# EAGLE design driver (EAGLE 8.0.1)

## Sheet 1 of 11: Arduino STM32F103C8T6
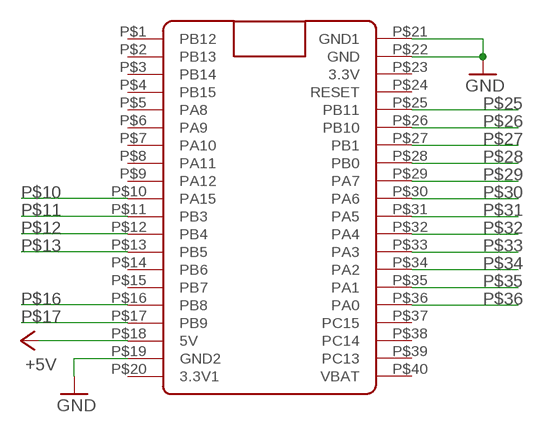
[diagram p0: schematic, sheet 1]

### Parts
U$1  STM32F103C8T6  BLUE_PILLADVANCED  [BLUE_PILL_ADV]

### Nets
+5V: U$1.P$18(5V) ; also sheet 4,5,6,7,8,9,11
GND: U$1.P$19(GND2) U$1.P$21(GND1) U$1.P$22(GND) ; also sheet 2,3,4,5,6,7,8,9,10,11
P$10: U$1.P$10(PA15) ; also sheet 5
P$11: U$1.P$11(PB3) ; also sheet 5
P$12: U$1.P$12(PB4) ; also sheet 5
P$13: U$1.P$13(PB5) ; also sheet 5
P$16: U$1.P$16(PB8) ; also sheet 6
P$17: U$1.P$17(PB9) ; also sheet 6
P$25: U$1.P$25(PB11) ; also sheet 11
P$26: U$1.P$26(PB10) ; also sheet 11
P$27: U$1.P$27(PB1) ; also sheet 11
P$28: U$1.P$28(PB0) ; also sheet 7
P$29: U$1.P$29(PA7) ; also sheet 8
P$30: U$1.P$30(PA6) ; also sheet 7
P$31: U$1.P$31(PA5) ; also sheet 9
P$32: U$1.P$32(PA4) ; also sheet 9
P$33: U$1.P$33(PA3) ; also sheet 10
P$34: U$1.P$34(PA2) ; also sheet 10
P$35: U$1.P$35(PA1) ; also sheet 10
P$36: U$1.P$36(PA0) ; also sheet 10
Unconnected: U$1.P$1(PB12) U$1.P$2(PB13) U$1.P$3(PB14) U$1.P$4(PB15) U$1.P$5(PA8) U$1.P$6(PA9) U$1.P$7(PA10) U$1.P$8(PA11) U$1.P$9(PA12) U$1.P$14(PB6) U$1.P$15(PB7) U$1.P$20(3.3V1) U$1.P$23(3.3V) U$1.P$24(RESET) U$1.P$37(PC15) U$1.P$38(PC14) U$1.P$39(PC13) U$1.P$40(VBAT)

## Sheet 2 of 11: Разъем для аккумулятора, выключатель и перемычки на землю
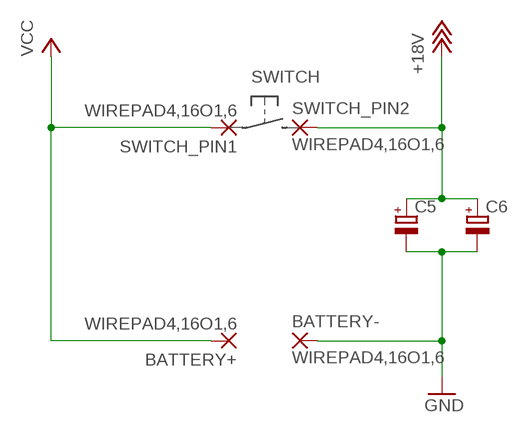
[diagram p1: schematic, sheet 2]

### Parts
BATTERY+  WIREPAD4,16O1,6  [4,16O1,6]
BATTERY-  WIREPAD4,16O1,6  [4,16O1,6]
C5  CPOL-EUE5-8.5  [E5-8,5]
C6  CPOL-EUE2.5-5  [E2,5-5]
SWITCH_PIN1  WIREPAD4,16O1,6  [4,16O1,6]
SWITCH_PIN2  WIREPAD4,16O1,6  [4,16O1,6]

### Nets
+18V: C5.+ C6.+ SWITCH_PIN2.1(P) ; also sheet 3,4,6
GND: BATTERY-.1(P) C5.- C6.- ; also sheet 1,3,4,5,6,7,8,9,10,11
VCC: BATTERY+.1(P) SWITCH_PIN1.1(P)

## Sheet 3 of 11: Линия питания 12V
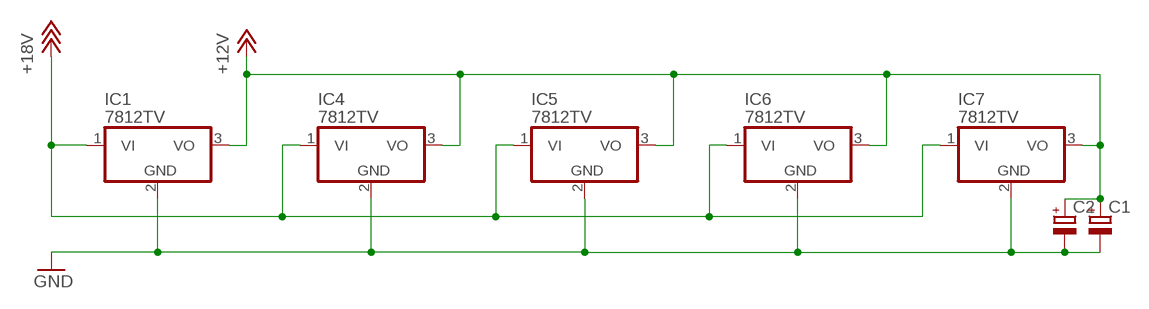
[diagram p2: schematic, sheet 3]

### Parts
C1  CPOL-EUE5-8.5  [E5-8,5]
C2  CPOL-EUE2.5-5  [E2,5-5]
IC1  7812TV  [TO220V]
IC4  7812TV  [TO220V]
IC5  7812TV  [TO220V]
IC6  7812TV  [TO220V]
IC7  7812TV  [TO220V]

### Nets
+12V: C1.+ C2.+ IC1.3(VO) IC4.3(VO) IC5.3(VO) IC6.3(VO) IC7.3(VO) ; also sheet 11
+18V: IC1.1(VI) IC4.1(VI) IC5.1(VI) IC6.1(VI) IC7.1(VI) ; also sheet 2,4,6
GND: C1.- C2.- IC1.2(GND) IC4.2(GND) IC5.2(GND) IC6.2(GND) IC7.2(GND) ; also sheet 1,2,4,5,6,7,8,9,10,11

## Sheet 4 of 11: Линия питания 5V
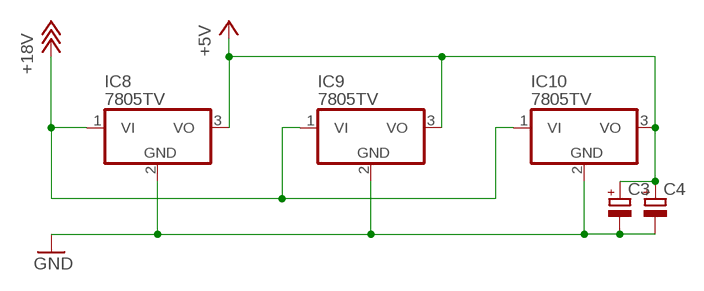
[diagram p3: schematic, sheet 4]

### Parts
C3  CPOL-EUE2.5-5  [E2,5-5]
C4  CPOL-EUE5-8.5  [E5-8,5]
IC8  7805TV  [TO220V]
IC9  7805TV  [TO220V]
IC10  7805TV  [TO220V]

### Nets
+5V: C3.+ C4.+ IC8.3(VO) IC9.3(VO) IC10.3(VO) ; also sheet 1,5,6,7,8,9,11
+18V: IC8.1(VI) IC9.1(VI) IC10.1(VI) ; also sheet 2,3,6
GND: C3.- C4.- IC8.2(GND) IC9.2(GND) IC10.2(GND) ; also sheet 1,2,3,5,6,7,8,9,10,11

## Sheet 5 of 11: Ультразвуковые датчики
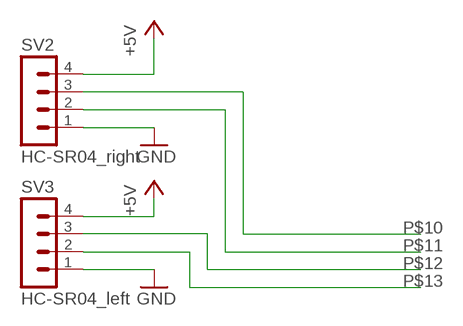
[diagram p4: schematic, sheet 5]

### Parts
SV2  HC-SR04_right  MA04-1  [MA04-1]
SV3  HC-SR04_left  MA04-1  [MA04-1]

### Nets
+5V: SV2.4 SV3.4 ; also sheet 1,4,6,7,8,9,11
GND: SV2.1 SV3.1 ; also sheet 1,2,3,4,6,7,8,9,10,11
P$10: SV2.3 ; also sheet 1
P$11: SV2.2 ; also sheet 1
P$12: SV3.3 ; also sheet 1
P$13: SV3.2 ; also sheet 1

## Sheet 6 of 11: Драйвер электромоторов
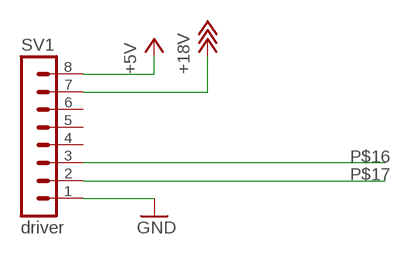
[diagram p5: schematic, sheet 6]

### Parts
SV1  driver  MA08-1  [MA08-1]

### Nets
+5V: SV1.8 ; also sheet 1,4,5,7,8,9,11
+18V: SV1.7 ; also sheet 2,3,4
GND: SV1.1 ; also sheet 1,2,3,4,5,7,8,9,10,11
P$16: SV1.3 ; also sheet 1
P$17: SV1.2 ; also sheet 1
Unconnected: SV1.4 SV1.5 SV1.6

## Sheet 7 of 11: Датчики числа оборотов колес
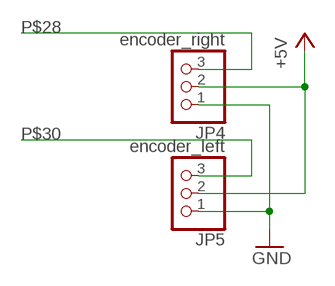
[diagram p6: schematic, sheet 7]

### Parts
JP4  encoder_right  PINHD-1X3  [1X03]
JP5  encoder_left  PINHD-1X3  [1X03]

### Nets
+5V: JP4.2 JP5.2 ; also sheet 1,4,5,6,8,9,11
GND: JP4.1 JP5.1 ; also sheet 1,2,3,4,5,6,8,9,10,11
P$28: JP4.3 ; also sheet 1
P$30: JP5.3 ; also sheet 1

## Sheet 8 of 11: Световая индикация
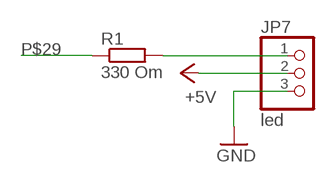
[diagram p7: schematic, sheet 8]

### Parts
JP7  led  PINHD-1X3  [1X03]
R1  330 Om  R-EU_0207/12  [0207/12]

### Nets
+5V: JP7.2 ; also sheet 1,4,5,6,7,9,11
GND: JP7.3 ; also sheet 1,2,3,4,5,6,7,9,10,11
N$16: JP7.1 R1.2
P$29: R1.1 ; also sheet 1

## Sheet 9 of 11: Датчик направления движения
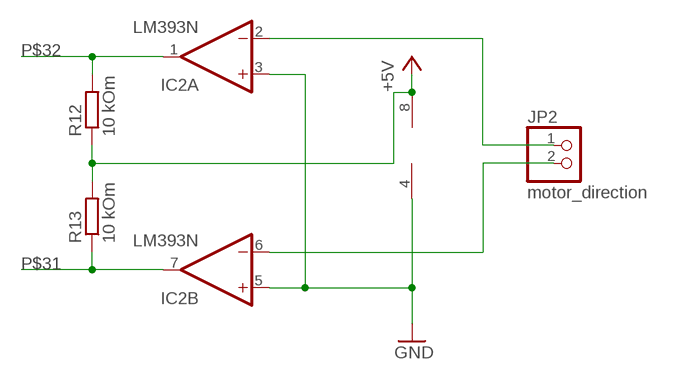
[diagram p8: schematic, sheet 9]

### Parts
IC2  LM393N  [DIL08]
JP2  motor_direction  PINHD-1X2  [1X02]
R12  10 kOm  R-EU_0207/12  [0207/12]
R13  10 kOm  R-EU_0207/12  [0207/12]

### Nets
+5V: IC2.8(P:V+) R12.1 R13.2 ; also sheet 1,4,5,6,7,8,11
GND: IC2.3(A:+IN) IC2.4(P:V-) IC2.5(B:+IN) ; also sheet 1,2,3,4,5,6,7,8,10,11
N$17: IC2.2(A:-IN) JP2.1
N$19: IC2.6(B:-IN) JP2.2
P$31: IC2.7(B:OUT) R13.1 ; also sheet 1
P$32: IC2.1(A:OUT) R12.2 ; also sheet 1

## Sheet 10 of 11: Датчик напряжения аккумулятора
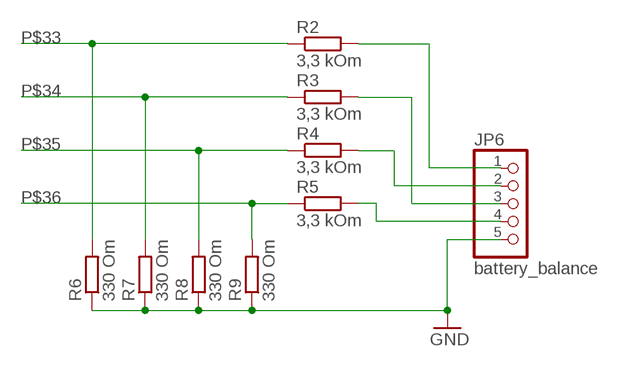
[diagram p9: schematic, sheet 10]

### Parts
JP6  battery_balance  PINHD-1X55X2MM  [1_05X2MM]
R2  3,3 kOm  R-EU_0207/15  [0207/15]
R3  3,3 kOm  R-EU_0207/15  [0207/15]
R4  3,3 kOm  R-EU_0207/15  [0207/15]
R5  3,3 kOm  R-EU_0207/15  [0207/15]
R6  330 Om  R-EU_0207/15  [0207/15]
R7  330 Om  R-EU_0207/15  [0207/15]
R8  330 Om  R-EU_0207/15  [0207/15]
R9  330 Om  R-EU_0207/15  [0207/15]

### Nets
GND: JP6.5 R6.1 R7.1 R8.1 R9.1 ; also sheet 1,2,3,4,5,6,7,8,9,11
N$5: JP6.4 R5.2
N$6: JP6.2 R4.2
N$7: JP6.3 R3.2
N$8: JP6.1 R2.2
P$33: R2.1 R6.2 ; also sheet 1
P$34: R3.1 R7.2 ; also sheet 1
P$35: R4.1 R8.2 ; also sheet 1
P$36: R5.1 R9.2 ; also sheet 1

## Sheet 11 of 11: Рулевое управление
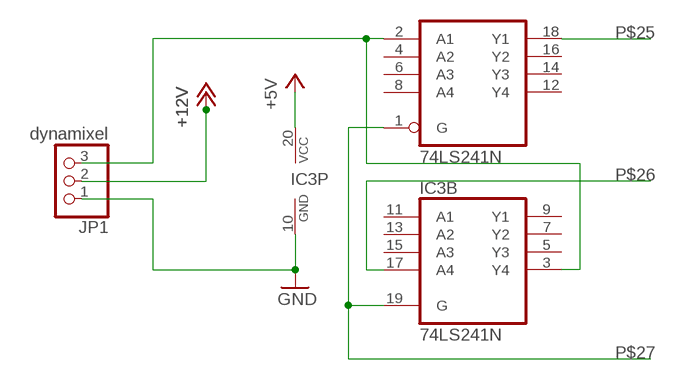
[diagram p10: schematic, sheet 11]

### Parts
IC3  74LS241N  [DIL20]
JP1  dynamixel  PINHD-1X3  [1X03]

### Nets
+5V: IC3.20(P:VCC) ; also sheet 1,4,5,6,7,8,9
+12V: JP1.2 ; also sheet 3
GND: IC3.10(P:GND) JP1.1 ; also sheet 1,2,3,4,5,6,7,8,9,10
N$2: IC3.2(A:A1) IC3.3(B:Y4) JP1.3
P$25: IC3.18(A:Y1) ; also sheet 1
P$26: IC3.17(B:A4) ; also sheet 1
P$27: IC3.1(A:G) IC3.19(B:G) ; also sheet 1
Unconnected: IC3.4(A:A2) IC3.5(B:Y3) IC3.6(A:A3) IC3.7(B:Y2) IC3.8(A:A4) IC3.9(B:Y1) IC3.11(B:A1) IC3.12(A:Y4) IC3.13(B:A2) IC3.14(A:Y3) IC3.15(B:A3) IC3.16(A:Y2)

## Library data of the parts
BATTERY+ BATTERY- SWITCH_PIN1 SWITCH_PIN2 = wirepad:WIREPAD: Wire PAD connect wire on PCB
C1-C6 = resistor:CPOL-EU: POLARIZED CAPACITOR, European symbol
IC1 IC4-IC10 = linear:78*: Positive VOLTAGE REGULATOR Source: http://cache.national.com/ds/LM/LM78L05.pdf http://www.fairchildsemi.com/ds/LM/LM7805.pdf
IC2 = linear:LM393: COMPARATOR
IC3 = 74xx-eu:74*241: Octal BUFFER and LINE DRIVER, 3-state
JP1 JP4 JP5 JP7 = pinhead:PINHD-1X3: PIN HEADER
JP2 = pinhead:PINHD-1X2: PIN HEADER
JP6 = pinhead:PINHD-1X5: PIN HEADER
R1-R9 R12 R13 = resistor:R-EU_: RESISTOR, European symbol
SV1 = con-lstb:MA08-1: PIN HEADER; OC_FARNELL: unknown; OC_NEWARK: unknown
SV2 SV3 = con-lstb:MA04-1: PIN HEADER; OC_FARNELL: unknown; OC_NEWARK: unknown
U$1 = BluePill:BLUE_PILL

## Board
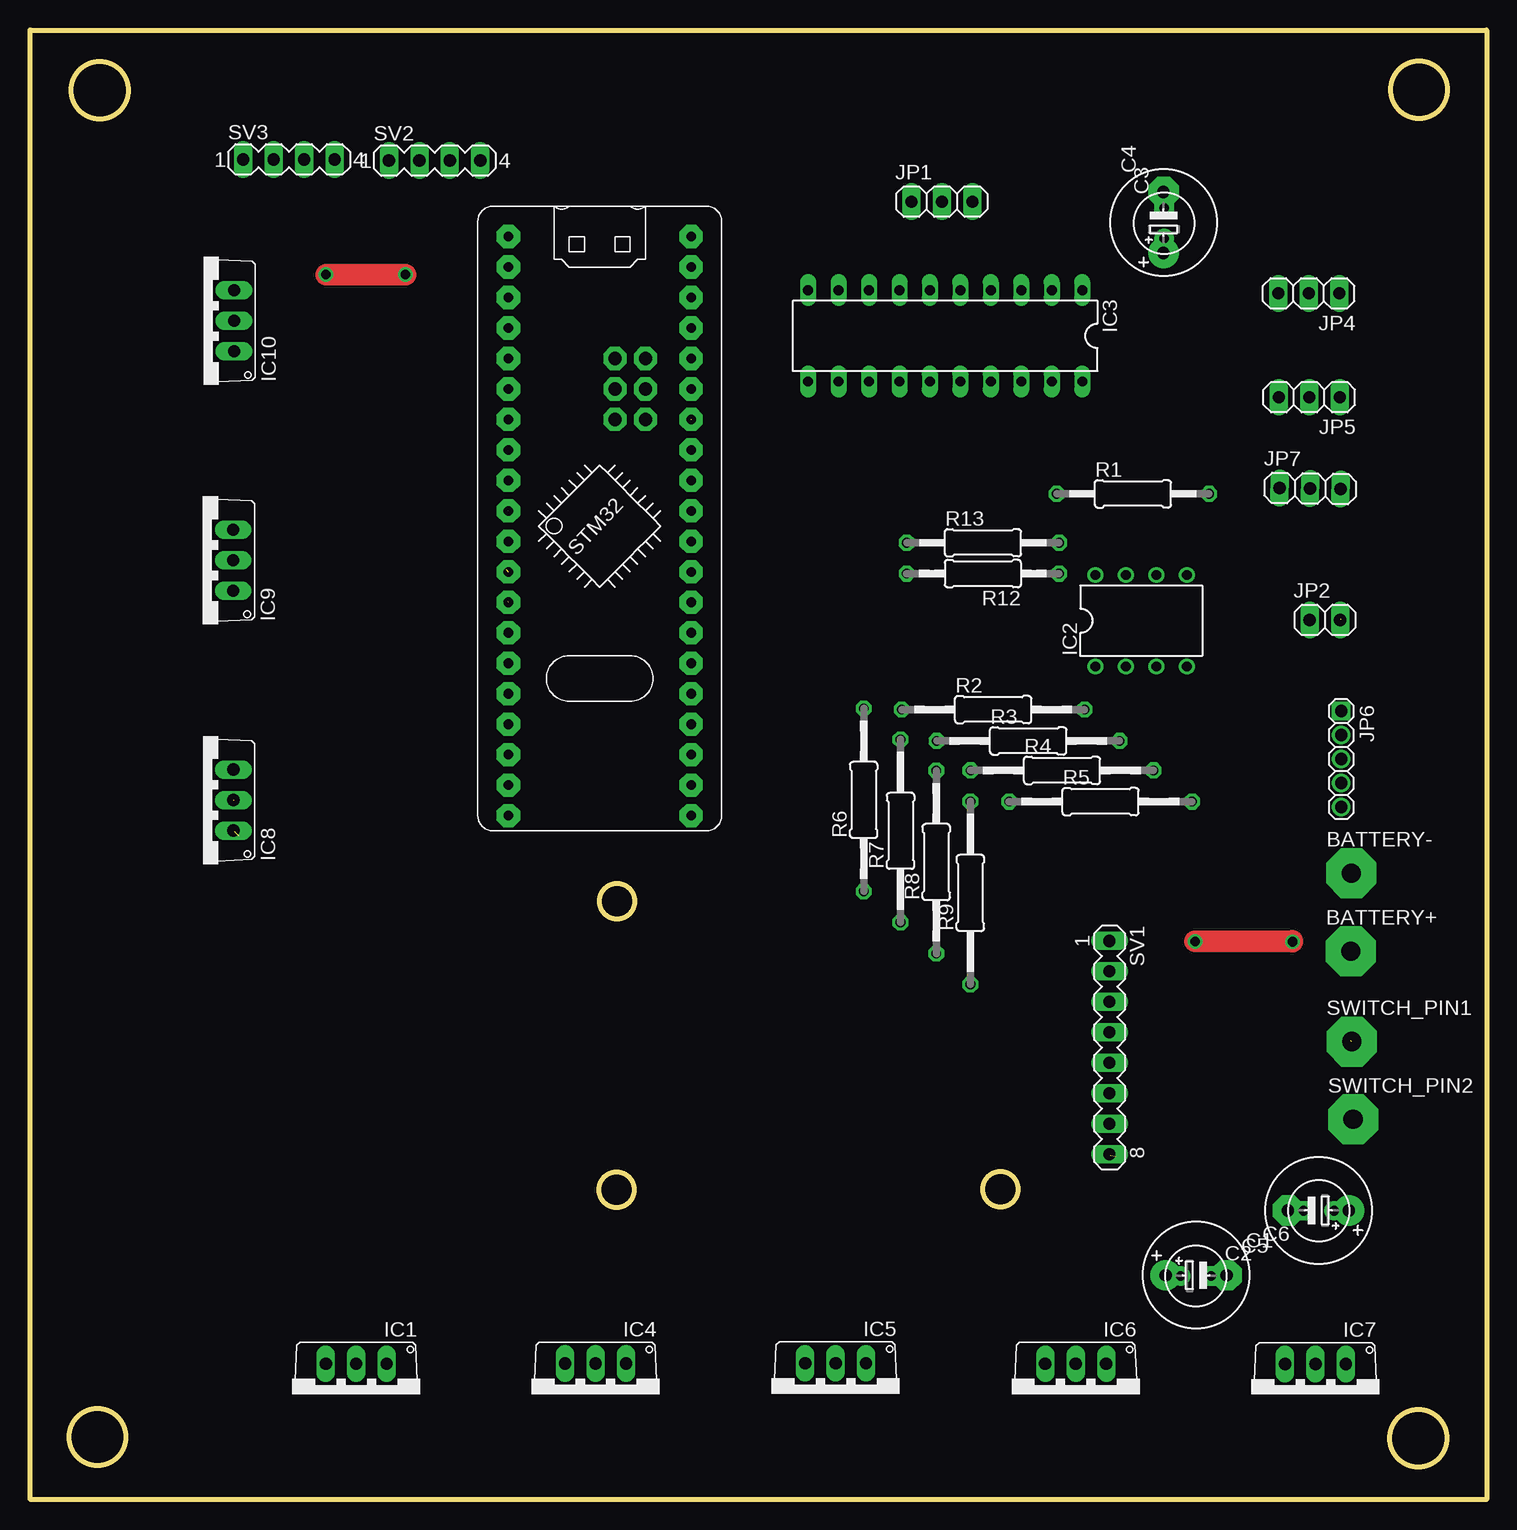
[diagram p11: board, top side]
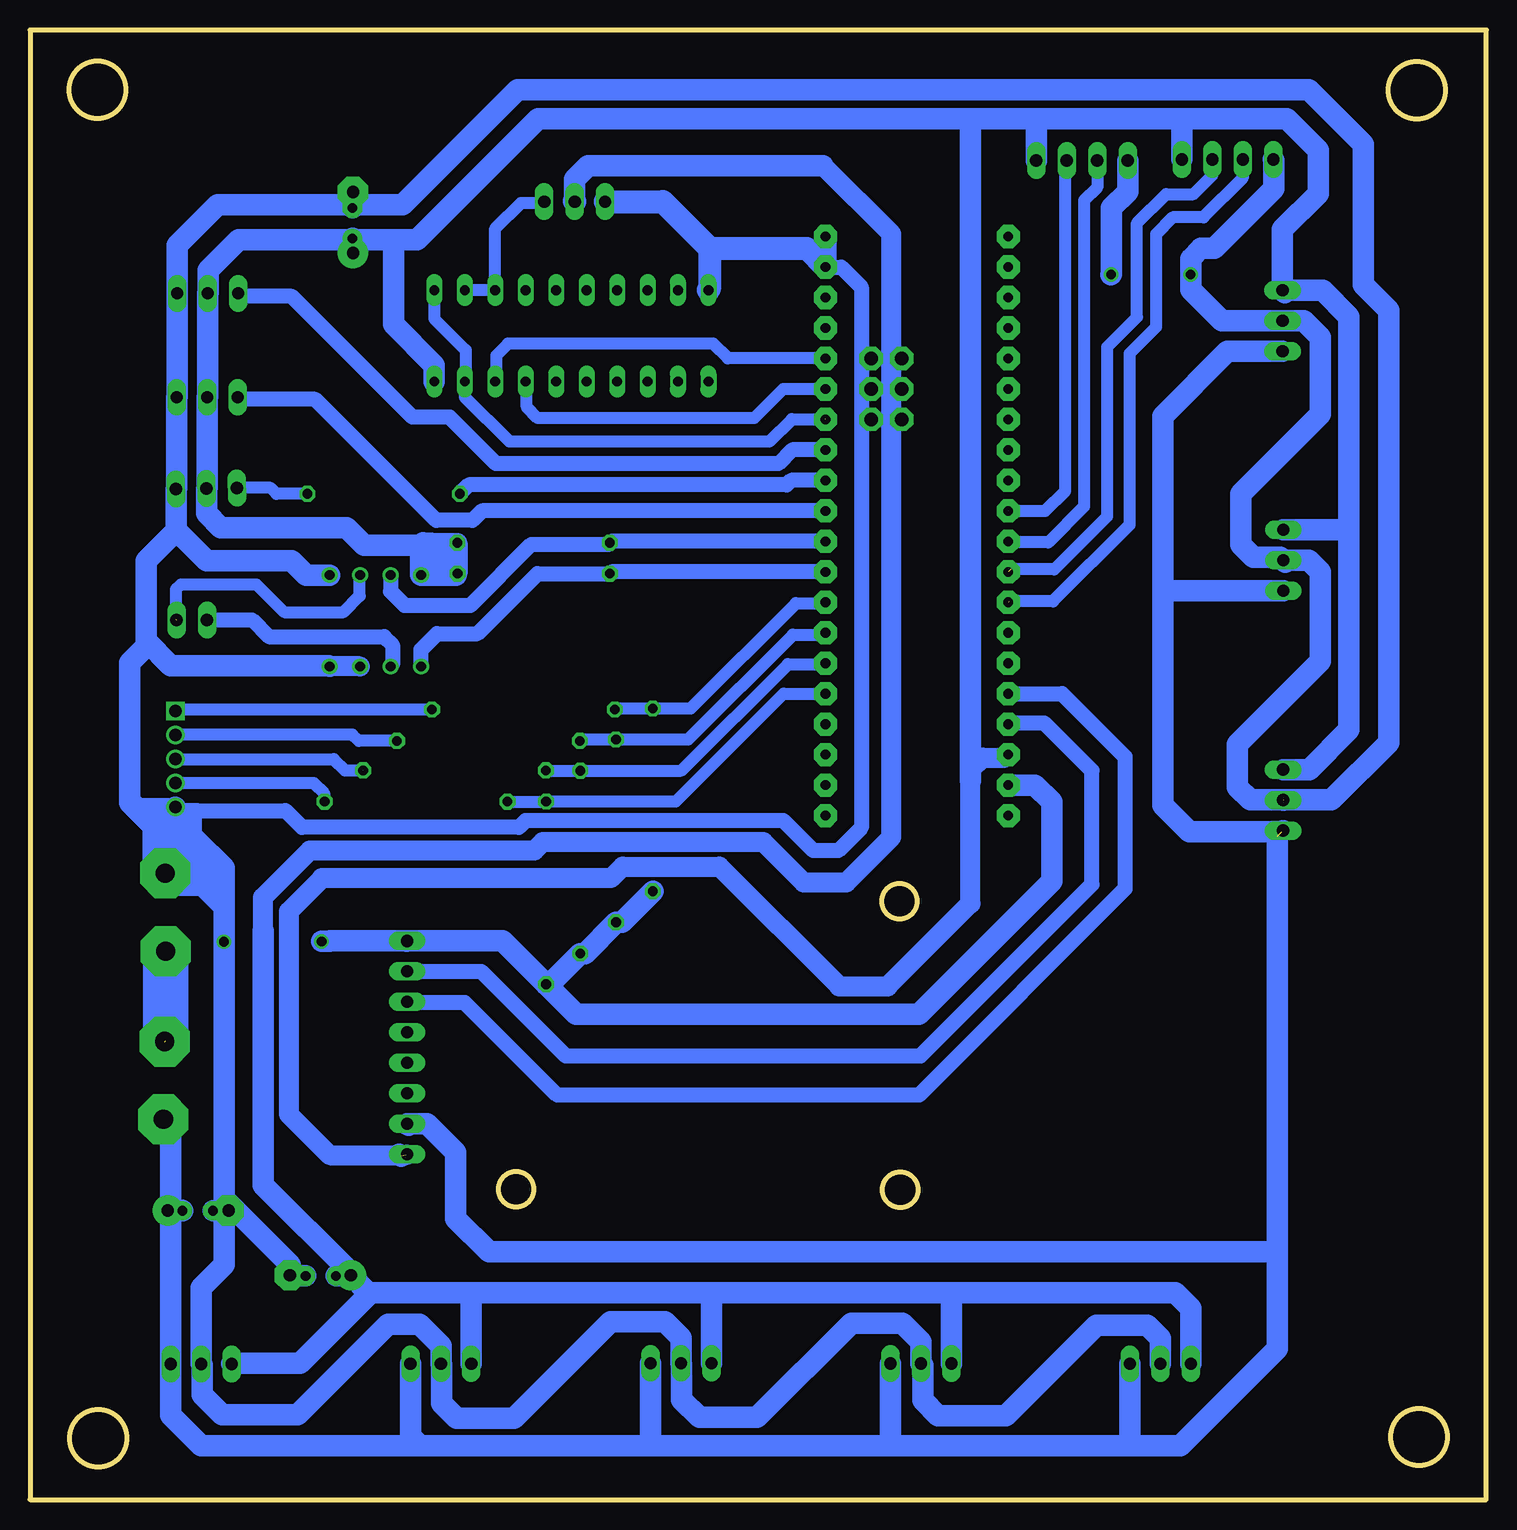
[diagram p12: board, bottom side, seen from below]

Size 121.42 x 122.46 mm. Coordinates in mm from the lower left corner, seen from the top.
Outline: 0,122.45 0.04,122.45 0.04,0 121.38,0
Outline: 0.05,122.46 121.42,122.46 121.42,0.01
Outline: circle at 115.72,5.1 radius 2.37
Outline: circle at 115.79,117.49 radius 2.37
Outline: circle at 48.88,25.83 radius 1.47
Outline: circle at 80.91,25.85 radius 1.47
Outline: circle at 48.95,49.85 radius 1.47
Outline: circle at 5.81,117.45 radius 2.37
Outline: circle at 5.63,5.21 radius 2.37
Copper layers (1*16): Top 0.035mm / dielectric 1.5mm / Bottom 0.035mm
Design rules "default": minimum track width 10mil, minimum drill 24mil, track to track 8mil, track to pad 8mil, pad to pad 8mil, via to via 8mil, smd to smd 8mil, copper to edge 40mil, drill to drill 8mil, minimum pad ring 10mil, minimum via ring 8mil, stop-mask expansion 4mil, vias tented up to drill 0mil, thermal gap 10mil

### Footprints (pad centres in the part's own frame; a part is rotated, then mirrored left to right if it is on the bottom)
4,16O1,6 = drill 1.6 pad 4.166 octagon: 1 0,0
E5-8,5 = drill 1.016 pad 2.54: + -2.54,0 | drill 1.016 pad 2.54 octagon: - 2.54,0
E2,5-5 = drill 0.813 pad 1.6: + -1.27,0 | drill 0.813 pad 1.6 octagon: - 1.27,0
TO220V = drill 1.016 long: 1 -2.54,-2.54; 2 0,-2.54; 3 2.54,-2.54
DIL08 = drill 0.813 pad 1.27: 1 -3.81,-3.81; 2 -1.27,-3.81; 3 1.27,-3.81; 4 3.81,-3.81; 5 3.81,3.81; 6 1.27,3.81; 7 -1.27,3.81; 8 -3.81,3.81
DIL20 = drill 0.813 long: 1 -11.43,-3.81; 2 -8.89,-3.81; 3 -6.35,-3.81; 4 -3.81,-3.81; 5 -1.27,-3.81; 6 1.27,-3.81; 7 3.81,-3.81; 8 6.35,-3.81; 9 8.89,-3.81; 10 11.43,-3.81; 11 11.43,3.81; 12 8.89,3.81; 13 6.35,3.81; 14 3.81,3.81; 15 1.27,3.81; 16 -1.27,3.81; 17 -3.81,3.81; 18 -6.35,3.81; 19 -8.89,3.81; 20 -11.43,3.81
1X03 = drill 1.016 long: 1 -2.54,0; 2 0,0; 3 2.54,0
1X02 = drill 1.016 long: 1 -1.27,0; 2 1.27,0
1_05X2MM = drill 1.016 pad 1.3 square: 1 -4,0 | drill 1.016 pad 1.3: 2 0,0; 3 -2,0; 4 2,0; 5 4,0
0207/12 = drill 0.813 octagon: 1 -6.35,0; 2 6.35,0
0207/15 = drill 0.813 octagon: 1 -7.62,0; 2 7.62,0
MA08-1 = drill 1.016 long: 1 -8.89,0; 2 -6.35,0; 3 -3.81,0; 4 -1.27,0; 5 1.27,0; 6 3.81,0; 7 6.35,0; 8 8.89,0
MA04-1 = drill 1.016 long: 1 -3.81,0; 2 -1.27,0; 3 1.27,0; 4 3.81,0
BLUE_PILL_ADV = drill 0.8 pad 1.93 octagon: P$1 10.16,-30.48; P$2 10.16,-27.94; P$3 10.16,-25.4; P$4 10.16,-22.86; P$5 10.16,-20.32; P$6 10.16,-17.78; P$7 10.16,-15.24; P$8 10.16,-12.7; P$9 10.16,-10.16; P$10 10.16,-7.62; P$11 10.16,-5.08; P$12 10.16,-2.54; P$13 10.16,0; P$14 10.16,2.54; P$15 10.16,5.08; P$16 10.16,7.62; P$17 10.16,10.16; P$18 10.16,12.7; P$19 10.16,15.24; P$20 10.16,17.78; P$21 -5.08,-30.48; P$22 -5.08,-27.94; P$23 -5.08,-25.4; P$24 -5.08,-22.86; P$25 -5.08,-20.32; P$26 -5.08,-17.78; P$27 -5.08,-15.24; P$28 -5.08,-12.7; P$29 -5.08,-10.16; P$30 -5.08,-7.62; P$31 -5.08,-5.08; P$32 -5.08,-2.54; P$33 -5.08,0; P$34 -5.08,2.54; P$35 -5.08,5.08; P$36 -5.08,7.62; P$37 -5.08,10.16; P$38 -5.08,12.7; P$39 -5.08,15.24; P$40 -5.08,17.78 | drill 1.1 pad 1.93 octagon: P$42 -1.27,-20.32; P$43 -1.27,-17.78; P$44 -1.27,-15.24; P$45 1.27,-15.24; P$46 1.27,-17.78; P$47 1.27,-20.32

### Placement (x,y rotation side)
BATTERY+  110.11,45.69 0 top
BATTERY-  110.15,52.2 0 top
C1  97.21,18.69 0 top
C2  97.18,18.63 0 top
C3  94.54,106.36 90 top
C4  94.49,106.42 90 top
C5  107.4,24.09 180 top
C6  107.44,24.07 180 top
IC1  27.2,8.78 180 top
IC2  92.63,73.23 0 top
IC3  76.29,96.97 180 top
IC4  47.14,8.79 180 top
IC5  67.16,8.82 180 top
IC6  87.17,8.78 180 top
IC7  107.16,8.76 180 top
IC8  14.42,58.29 90 top
IC9  14.4,78.27 90 top
IC10  14.47,98.22 90 top
JP1  76.01,108.16 0 top
JP2  107.94,73.3 0 top
JP4  106.6,100.51 180 top
JP5  106.64,91.86 180 top
JP6  109.3,61.71 270 top
JP7  106.71,84.25 359 top
R1  91.94,83.81 0 top
R2  80.29,65.83 0 top
R3  83.21,63.22 0 top
R4  86.03,60.76 0 top
R5  89.24,58.16 0 top
R6  69.5,58.3 90 top
R7  72.57,55.72 90 top
R8  75.55,53.12 90 top
R9  78.39,50.55 90 top
R12  79.43,77.16 180 top
R13  79.44,79.73 0 top
SV1  89.99,37.66 270 top
SV2  33.73,111.58 0 top
SV3  21.59,111.67 0 top
SWITCH_PIN1  110.18,38.16 0 top
SWITCH_PIN2  110.3,31.68 0 top
U$1  50.03,74.77 180 top

### Tracks (layer width: path | path; a pad name or v marks a point on that pad's centre or on a via)
+5V  (1 unrouted)
  Bottom 1.016: 106.71,91.79 JP5.2 | JP4.2 106.64,100.47 | 88.7,77.16 IC2.8 | 87.96,92.92 IC3.20
  Bottom 1.676: U$1.P$18 40.11,61.83 42,61.83 43.02,60.81 43.02,59.9 43.02,49.67 49.93,42.76 53.96,42.76 63.95,52.75 72.02,52.75 72.99,51.78 97.07,51.78 99.85,49 99.85,32.12 96.44,28.71 90.05,28.71 SV1.8 | 87.83,79.73 88.67,79.73 88.67,78.66 87.58,77.57 88.33,77.57 88.84,77.06 | 87.83,79.73 R13.2 R12.1 85.78,77.68 87.83,79.73
  Bottom 1.778: 88.88,79.52 93.57,79.52 95.04,80.99 105.53,80.99 106.71,82.17 JP7.2 106.64,84.32 JP5.2 106.6,91.9 JP4.2 106.56,100.55 106.56,102.45 104.02,104.99 95.42,104.99 | 88.88,79.52 88.84,79.48 88.84,77.06 IC2.8 | IC2.8 85.9,77.04 | 88.88,79.52 88.67,79.73 | IC2.8 88.48,77.04 | 25.4,112.14 SV3.4 25.4,114.97 25.32,115.05 | U$1.P$18 39.82,62.12 | 39.84,62.1 U$1.P$18 | 16.81,100.56 IC10.3 | 39.82,62.02 U$1.P$18 | 90.66,28.76 90.5,28.6 | IC10.3 13.66,100.76 11.47,98.57 11.47,81.16 | 11.47,81.16 11.47,64.15 14.79,60.83 IC8.3 | IC9.3 11.82,80.81 11.47,81.16 | IC10.3 17.01,105.86 14.04,108.83 14.04,112.44 16.65,115.05 25.32,115.05 | 25.32,115.05 37.38,115.05 | 42.57,115.05 37.38,115.05 | 42.57,115.05 79.07,115.05 89.13,104.99 91.05,104.99 | 95.42,104.99 91.05,104.99 | IC3.20 87.72,94.52 91.12,97.92 91.12,104.92 91.05,104.99 | SV2.4 37.54,114.89 37.38,115.05 | 43.02,59.9 43.02,114.6 42.57,115.05 | C3.+ 94.49,105.04 C4.+ 94.49,104.06 95.42,104.99
+12V
  Bottom 1.016: 75.84,108.33 JP1.2
  Bottom 1.676: 102,47.39 102,50.18 98.1,54.08 79.38,54.08 78.68,54.78 60.29,54.78 56.92,51.41 53.39,51.41 49.61,55.19 49.61,105.47 55.3,111.16
  Bottom 1.778: IC1.3 24.66,15.96 25.94,17.24 44.44,17.24 | 64.87,17.24 84.69,17.24 | 44.44,17.24 64.87,17.24 | 84.69,17.24 93.03,17.24 | 93.03,17.24 98.92,11.35 104.57,11.35 IC7.3 | IC6.3 84.63,17.18 84.69,17.24 | IC5.3 64.62,16.99 64.87,17.24 | IC4.3 44.6,17.08 44.44,17.24 | 102,47.39 102,26.21 94.67,18.88 C1.+ | JP1.2 76.01,110.03 74.88,111.16 55.3,111.16 | C2.+ 94.67,18.63 C1.+ | 93.03,17.24 93.22,17.24 C1.+
  Bottom 1.93: 76.04,108.19 JP1.2
+18V  (1 unrouted)
  Bottom 1.778: 90.01,31.29 SV1.7 | 89.86,31.18 SV1.7 | 49.53,4.48 29.73,4.48 | 70,4.48 49.53,4.48 | 88.91,4.48 70,4.48 | 88.91,4.48 107.17,4.48 109.7,7.01 IC7.1 109.7,24.84 | 29.73,4.48 25.53,4.48 17.45,12.56 17.45,20.31 | 17.45,20.31 17.45,55.26 | IC1.1 29.74,4.49 29.73,4.48 | IC4.1 49.68,4.63 49.53,4.48 | IC5.1 69.7,4.78 70,4.48 | IC6.1 89.71,5.28 88.91,4.48 | 109.7,30.35 109.7,24.84 | 109.7,30.35 109.7,31.36 110.6,32.26 | SV1.7 88.3,31.31 85.93,28.94 85.93,23.41 83.16,20.64 17.78,20.64 17.45,20.31 | 16.99,55.72 IC8.1 17.07,55.64 24.76,55.64 26.98,57.86 26.98,75.24 | IC10.1 21.59,95.68 26.98,90.29 26.98,75.24 | IC9.1 26.49,75.73 26.98,75.24 | C6.+ 108.73,24.09 C5.+ 109.94,24.6 109.7,24.84 | SWITCH_PIN2.1 110.3,31.25 110.6,30.95 110.3,30.95 109.7,30.35
GND  (via drill 0.8 pad 1.02)  (1 unrouted)
  Top 1.778: v97.11,46.51 105.2,46.51 105.24,46.55 v105.24,46.48 | v31.3,102.08 24.69,102.08 24.67,102.06 v24.67,102.08
  Bottom 1.016: R9.1 75.82,45.5 R8.1 72.95,48.1 R7.1 69.99,50.68 R6.1 69.52,50.7 | 109.25,91.79 JP5.1 | 109.18,100.47 JP4.1 | JP7.3 109.17,84.13
  Bottom 1.27: U$1.P$22 53.79,102.71 52.11,101.03 52.11,56 54.03,54.08 56.12,54.08 58.61,56.57 80.12,56.57 80.67,56.02 98.74,56.02 100.12,57.4 107.5,57.4 | 107.5,57.4 108.99,57.4 JP6.5 | 107.69,55.08 107.69,57.22 107.5,57.4
  Bottom 1.676: IC2.3 IC2.4 | 105.24,24.52 105.24,23.34 | v97.11,46.51 97.04,46.51
  Bottom 1.778: IC1.2 27.2,13.45 28.28,14.53 32.52,14.53 40.05,7 45.73,7 47,8.27 47,11.19 IC4.2 47.14,13.15 48.69,14.7 52.96,14.7 60.81,6.85 65.61,6.85 67.09,8.33 67.09,11.29 IC5.2 67.16,13.47 68.5,14.81 73.02,14.81 81.06,6.77 85.85,6.77 87.12,8.04 87.12,11.27 IC6.2 87.17,12.81 88.96,14.6 91.57,14.6 99.11,7.06 105.39,7.06 107.08,8.75 107.08,11.22 IC7.2 107.16,17.66 105.24,19.58 105.24,23.34 105.24,25.06 | 78.42,42.9 R9.1 | R9.1 78.12,42.93 R8.1 75.17,45.5 R7.1 72.08,48.1 R6.1 | SV2.1 29.92,109 31.28,107.64 31.28,102.1 v31.3,102.08 | SV1.1 82.01,46.55 R9.1 | IC2.5 98.4,77.04 99.59,78.23 106.7,78.23 109.23,80.76 | 109.23,80.76 109.23,84.19 JP7.3 109.18,84.28 JP5.1 109.14,91.9 JP4.1 109.14,104.52 105.76,107.9 94.02,107.9 | 109.23,80.76 109.23,80.75 111.75,78.23 111.75,71.57 | 111.75,71.57 109.68,69.5 96.52,69.5 IC2.4 | 111.75,71.57 111.75,71.1 113.12,69.73 113.12,58.23 | 113.12,58.23 112.44,57.55 109.46,57.55 JP6.5 109.3,56.7 107.69,55.08 105.24,52.64 105.24,49.4 | 94.02,107.9 90.34,107.9 80.77,117.47 14.82,117.47 10.28,112.93 10.28,101.24 8.15,99.11 8.15,63.08 12.93,58.3 IC8.2 | U$1.P$19 37.63,59.53 36.25,58.15 36.25,51.51 47.3,40.46 75.92,40.46 R9.1 | 78.26,42.8 R9.1 | 105.24,25.06 v105.24,46.48 105.24,49.4 | 90.03,46.51 SV1.1 | IC10.2 | 17.05,78.38 IC9.2 | 16.76,78.09 IC9.2 | IC10.2 15.23,98.22 13.86,96.85 13.86,90.46 20.5,83.82 20.5,79.58 19.43,78.51 17.18,78.51 IC9.2 | IC9.2 14.82,78.27 13.86,77.31 13.86,69.85 20.76,62.95 20.76,59.36 19.7,58.3 IC8.2 | SV1.1 96.39,46.55 96.43,46.51 v97.11,46.51 | BATTERY-.1 108.04,52.2 105.24,49.4 | 113.12,58.23 113.12,58.05 110.92,55.85
  Bottom 1.778: IC10.2 22.06,98.22 24.67,100.83 v24.67,102.08 24.67,103.39 23.8,104.26 22.7,104.26 17.73,109.23 17.73,111.62 SV3.1 | C2.- 99.69,18.63 C1.- 99.75,19.57 104.86,24.68 | C6.- 104.88,24.07 C5.- 104.86,24.68 | 104.86,24.68 105.24,25.06 | C3.- 94.54,108.91 C4.- 94.49,108.37 94.02,107.9
  Bottom 1.93: JP1.1 68.67,108.16 64.78,104.27 | 64.78,104.27 64.78,100.86 IC3.10 | 64.78,104.27 56.67,104.27 U$1.P$22 U$1.P$21
  Bottom 3.81: 110.14,56.43 110.15,56.42 BATTERY-.1 106.52,52.2 106.44,52.28 108.35,54.19
N$2
  Bottom 1.016: IC3.2 IC3.3 82.64,105.92 80.5,108.06 78.65,108.06 JP1.3
N$5
  Bottom 1.016: R5.2 96.86,58.8 97.77,59.71 JP6.4
N$6  (1 unrouted)
  Bottom 1.016: JP6.2 96.1,61.71 95.16,60.77 R4.2
N$7
  Bottom 1.016: JP6.3 109.26,63.75 94.55,63.75 94.02,63.22 R3.2
N$8
  Bottom 1.016: 109.18,65.83 JP6.1 109.18,65.83 | R2.2 109.18,65.83
N$16
  Bottom 1.016: R1.2 100.86,83.81 101.36,84.31 104.16,84.31 JP7.1
N$17
  Bottom 1.27: JP2.1 102.92,73.3 101.52,71.9 91.89,71.9 91.21,71.22 91.21,69.57 IC2.2
N$19  (1 unrouted)
  Bottom 1.016: 109.26,73.35 109.26,75.84 108.83,76.27 102.55,76.27 100.23,73.95 95.29,73.95 93.94,75.3 93.94,77 IC2.6
P$10  (1 unrouted)
  Bottom 1.016: SV2.3 35.12,111.46 35.12,84.06 36.8,82.38 U$1.P$10
P$11
  Bottom 1.016: SV2.2 32.46,109.33 33.55,108.24 33.55,82.76 36.54,79.77 39.79,79.77 U$1.P$11
P$12  (1 unrouted)
  Bottom 1.016: SV3.3 22.86,110.35 24.43,108.78 26.73,108.78 29.13,106.38 29.13,98.54 31.62,96.05 31.62,81.93 36.04,77.51 39.67,77.51
P$13  (1 unrouted)
  Bottom 1.016: SV3.2 20.32,110.12 23.6,106.84 26.18,106.84 27.56,105.46 27.56,97.71 29.77,95.5 29.77,81.2 36.13,74.84 39.8,74.84
P$16
  Bottom 1.27: SV1.3 89.93,41.41 85.18,41.41 77.48,33.71 47.3,33.71 30.13,50.88 30.13,61.9 35.38,67.15 U$1.P$16
P$17
  Bottom 1.27: SV1.2 83.8,44.01 76.76,36.97 47.19,36.97 32.89,51.27 32.89,60.74 36.86,64.71 39.77,64.71 U$1.P$17
P$25
  Bottom 1.016: U$1.P$25 63.24,95.09 64.47,96.32 81.57,96.32 82.56,95.33 82.56,93.24 IC3.18
P$26
  Bottom 1.016: IC3.17 80.02,93.08 80.02,91.05 79.09,90.12 61.05,90.12 58.62,92.55 U$1.P$26
P$27  (1 unrouted)
  Bottom 1.016: 55.14,90.04 57.92,90.04 59.79,88.17 81.46,88.17 85.18,91.89 IC3.19 85.1,93.24 85.1,95.79 87.72,98.41 IC3.1
P$28
  Bottom 1.27: U$1.P$28 57.89,87.47 59.04,86.32 82.57,86.32 86.44,90.19 89.53,90.19 99.6,100.26 103.81,100.26 JP4.3
P$29
  Bottom 1.27: U$1.P$29 57.97,84.93 58.34,84.56 84.84,84.56 R1.1
P$30
  Bottom 1.27: U$1.P$30 83.74,82.39 84.53,81.6 87.56,81.6 97.63,91.67 103.91,91.67 JP5.3
P$31
  Bottom 1.27: U$1.P$31 72.97,79.85 R13.1 73.22,79.6 79.63,79.6 84.71,74.52 90.2,74.52 91.36,75.68 IC2.7
P$32
  Bottom 1.27: U$1.P$32 72.93,77.31 R12.2 79.11,77.16 84.12,72.15 87.49,72.15 88.82,70.82 IC2.1
P$33
  Bottom 1.016: R2.1 72.58,65.92 R6.2 66.34,65.92 57.57,74.69 55.19,74.69 U$1.P$33
P$34
  Bottom 1.016: R3.1 75.47,63.34 R7.2 66.55,63.34 57.82,72.07 55.27,72.07 U$1.P$34
P$35
  Bottom 1.016: R4.1 78.39,60.74 R8.2 67.13,60.74 58.25,69.62 55.18,69.62 U$1.P$35
P$36
  Bottom 1.016: 81.55,58.23 R5.1 R9.2 67.58,58.17 58.59,67.16 U$1.P$36
VCC  (1 unrouted)
  Bottom 3.81: BATTERY+.1 110.11,38.23